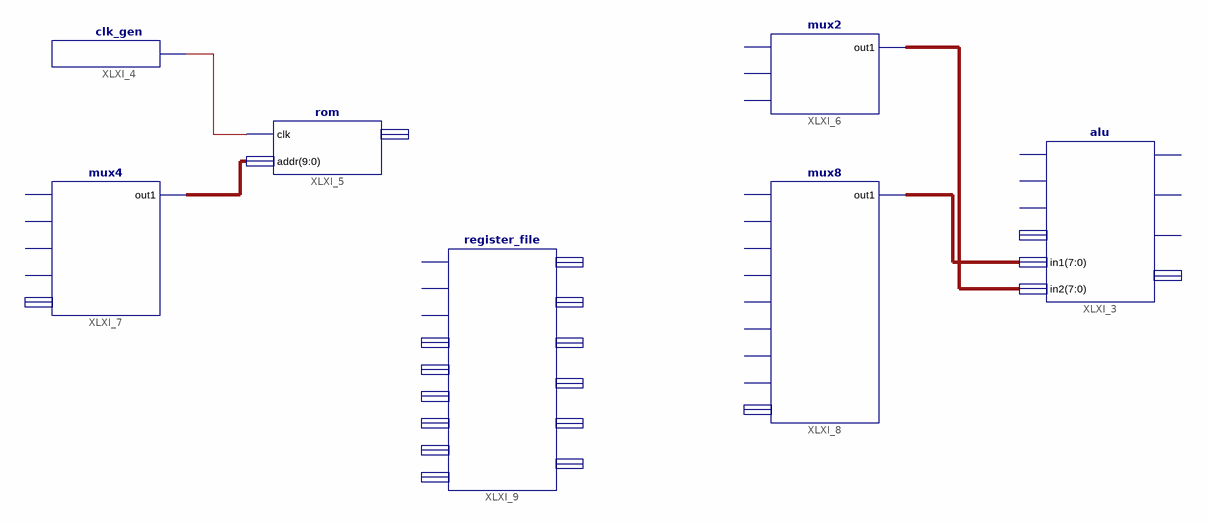
[diagram p0: schematic sheet 1]
// Xilinx ISE schematic top_level.sch (spartan6) as structural Verilog: 7 symbols, 0 ports
module top_level (
);

  wire XLXN_1;
  wire [7:0] XLXN_9, XLXN_10;
  wire [9:0] XLXN_2;

  alu XLXI_3 (.in1(XLXN_10), .in2(XLXN_9));  // open: Cin, uc, ed, op, Z, Cout, V_P, out1
  clk_gen XLXI_4 (.clk(XLXN_1));
  rom XLXI_5 (.clk(XLXN_1), .addr(XLXN_2));  // open: data
  mux2 XLXI_6 (.out1(XLXN_9));  // open: ctrl, in1, in2
  mux4 XLXI_7 (.out1(XLXN_2));  // open: in1, in2, in3, in4, ctrl
  mux8 XLXI_8 (.out1(XLXN_10));  // open: in1, in2, in3, in4, in5, in6, in7, in8, ctrl
  register_file XLXI_9 ();  // open: clk, rw, flctrl, addro, pcctrl, in1, in2, alu, flags, ro, rd, r13, r14, r15, pc
endmodule
